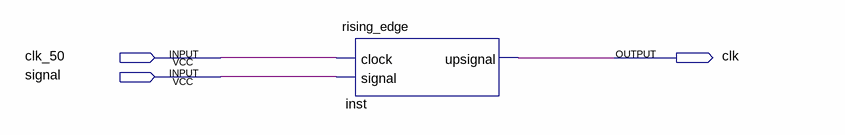
[diagram p0: schematic sheet]
// Quartus schematic rising_edge_test.bdf as structural Verilog: 1 symbols, 3 pins
module rising_edge_test (
  input  clk_50,
  input  signal,
  output clk
);

  rising_edge inst (.clock(clk_50), .signal(signal), .upsignal(clk));
endmodule
